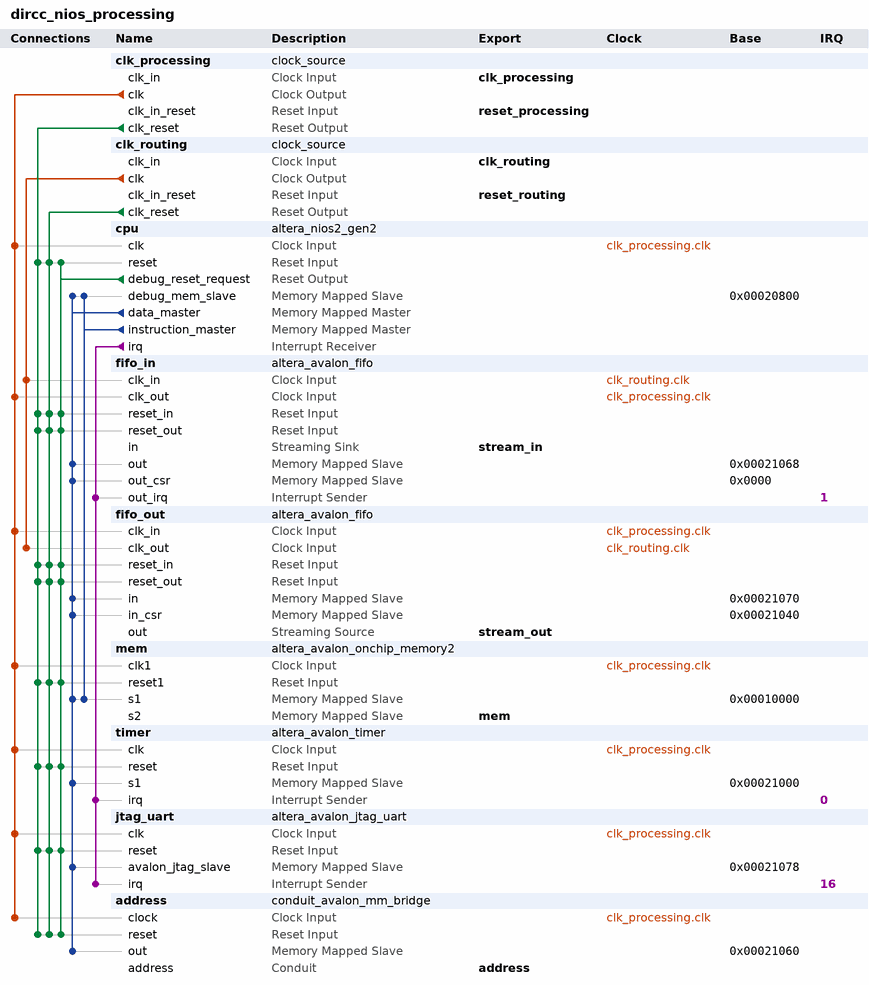
[diagram p0: system contents]
# Platform Designer (Qsys) system dircc_nios_processing, Cyclone V 5CSEMA5F31C6
# Parameters at their usual value, and those the tool derives, are not listed.
package require -exact qsys 16.1
create_system dircc_nios_processing
set_project_property DEVICE_FAMILY {Cyclone V}
set_project_property DEVICE 5CSEMA5F31C6

add_instance clk_processing clock_source 16.1
set_instance_parameter_value clk_processing clockFrequency 50000000
set_instance_parameter_value clk_processing clockFrequencyKnown false
set_instance_parameter_value clk_processing resetSynchronousEdges DEASSERT

add_instance clk_routing clock_source 16.1
set_instance_parameter_value clk_routing clockFrequency 200000000
set_instance_parameter_value clk_routing resetSynchronousEdges DEASSERT

add_instance cpu altera_nios2_gen2 16.1
set_instance_parameter_value cpu dcache_size 1024
set_instance_parameter_value cpu exceptionOffset 3104
set_instance_parameter_value cpu exceptionSlave mem.s1
set_instance_parameter_value cpu icache_size 4096
set_instance_parameter_value cpu impl Tiny
set_instance_parameter_value cpu resetOffset 3072
set_instance_parameter_value cpu resetSlave mem.s1

add_instance fifo_in altera_avalon_fifo 16.1
set_instance_parameter_value fifo_in bitsPerSymbol 8
set_instance_parameter_value fifo_in channelWidth 0
set_instance_parameter_value fifo_in errorWidth 0
set_instance_parameter_value fifo_in fifoDepth 16
set_instance_parameter_value fifo_in fifoInputInterfaceOptions AVALONST_SINK
set_instance_parameter_value fifo_in fifoOutputInterfaceOptions AVALONMM_READ
set_instance_parameter_value fifo_in singleClockMode false
set_instance_parameter_value fifo_in symbolsPerBeat 4
set_instance_parameter_value fifo_in useIRQ true
set_instance_parameter_value fifo_in usePacket true
set_instance_parameter_value fifo_in useReadControl true
set_instance_parameter_value fifo_in useRegister true
set_instance_parameter_value fifo_in useWriteControl false

add_instance fifo_out altera_avalon_fifo 16.1
set_instance_parameter_value fifo_out bitsPerSymbol 8
set_instance_parameter_value fifo_out channelWidth 0
set_instance_parameter_value fifo_out errorWidth 0
set_instance_parameter_value fifo_out fifoDepth 16
set_instance_parameter_value fifo_out fifoInputInterfaceOptions AVALONMM_WRITE
set_instance_parameter_value fifo_out fifoOutputInterfaceOptions AVALONST_SOURCE
set_instance_parameter_value fifo_out singleClockMode false
set_instance_parameter_value fifo_out symbolsPerBeat 4
set_instance_parameter_value fifo_out useIRQ false
set_instance_parameter_value fifo_out usePacket true
set_instance_parameter_value fifo_out useReadControl false
set_instance_parameter_value fifo_out useRegister true

add_instance mem altera_avalon_onchip_memory2 16.1
set_instance_parameter_value mem dataWidth 32
set_instance_parameter_value mem dualPort true
set_instance_parameter_value mem enableDiffWidth true
set_instance_parameter_value mem initMemContent true
set_instance_parameter_value mem initializationFileName /home/patrick/Documents/Coursework/DiRCC/software/dircc_application_gals_27/mem_init/dircc_system_node_dual_node_0_processing_mem.hex
set_instance_parameter_value mem memorySize 30000
set_instance_parameter_value mem readDuringWriteMode OLD_DATA
set_instance_parameter_value mem resetrequest_enabled false
set_instance_parameter_value mem singleClockOperation true
set_instance_parameter_value mem useNonDefaultInitFile true

add_instance timer altera_avalon_timer 16.1
set_instance_parameter_value timer period 1
set_instance_parameter_value timer periodUnits MSEC

add_instance jtag_uart altera_avalon_jtag_uart 16.1
set_instance_parameter_value jtag_uart readBufferDepth 8
set_instance_parameter_value jtag_uart readIRQThreshold 4
set_instance_parameter_value jtag_uart simInteractiveOptions NO_INTERACTIVE_WINDOWS
set_instance_parameter_value jtag_uart writeBufferDepth 8
set_instance_parameter_value jtag_uart writeIRQThreshold 4

add_instance address conduit_avalon_mm_bridge 1.0

# connections
add_connection clk_processing.clk address.clock clock
add_connection clk_processing.clk cpu.clk clock
add_connection clk_processing.clk fifo_in.clk_out clock
add_connection clk_processing.clk fifo_out.clk_in clock
add_connection clk_processing.clk jtag_uart.clk clock
add_connection clk_processing.clk mem.clk1 clock
add_connection clk_processing.clk timer.clk clock
add_connection clk_routing.clk fifo_in.clk_in clock
add_connection clk_routing.clk fifo_out.clk_out clock
add_connection clk_processing.clk_reset address.reset reset
add_connection clk_processing.clk_reset cpu.reset reset
add_connection clk_processing.clk_reset fifo_in.reset_in reset
add_connection clk_processing.clk_reset fifo_in.reset_out reset
add_connection clk_processing.clk_reset fifo_out.reset_in reset
add_connection clk_processing.clk_reset fifo_out.reset_out reset
add_connection clk_processing.clk_reset jtag_uart.reset reset
add_connection clk_processing.clk_reset mem.reset1 reset
add_connection clk_processing.clk_reset timer.reset reset
add_connection clk_routing.clk_reset address.reset reset
add_connection clk_routing.clk_reset cpu.reset reset
add_connection clk_routing.clk_reset fifo_in.reset_in reset
add_connection clk_routing.clk_reset fifo_in.reset_out reset
add_connection clk_routing.clk_reset fifo_out.reset_in reset
add_connection clk_routing.clk_reset fifo_out.reset_out reset
add_connection clk_routing.clk_reset jtag_uart.reset reset
add_connection clk_routing.clk_reset mem.reset1 reset
add_connection clk_routing.clk_reset timer.reset reset
add_connection cpu.debug_reset_request address.reset reset
add_connection cpu.debug_reset_request cpu.reset reset
add_connection cpu.debug_reset_request fifo_in.reset_in reset
add_connection cpu.debug_reset_request fifo_in.reset_out reset
add_connection cpu.debug_reset_request fifo_out.reset_in reset
add_connection cpu.debug_reset_request fifo_out.reset_out reset
add_connection cpu.debug_reset_request jtag_uart.reset reset
add_connection cpu.debug_reset_request mem.reset1 reset
add_connection cpu.debug_reset_request timer.reset reset
add_connection cpu.data_master address.out avalon
set_connection_parameter_value cpu.data_master/address.out baseAddress 0x00021060
add_connection cpu.data_master cpu.debug_mem_slave avalon
set_connection_parameter_value cpu.data_master/cpu.debug_mem_slave baseAddress 0x00020800
add_connection cpu.data_master fifo_in.out avalon
set_connection_parameter_value cpu.data_master/fifo_in.out baseAddress 0x00021068
add_connection cpu.data_master fifo_in.out_csr avalon
set_connection_parameter_value cpu.data_master/fifo_in.out_csr baseAddress 0x0000
add_connection cpu.data_master fifo_out.in avalon
set_connection_parameter_value cpu.data_master/fifo_out.in baseAddress 0x00021070
add_connection cpu.data_master fifo_out.in_csr avalon
set_connection_parameter_value cpu.data_master/fifo_out.in_csr baseAddress 0x00021040
add_connection cpu.data_master jtag_uart.avalon_jtag_slave avalon
set_connection_parameter_value cpu.data_master/jtag_uart.avalon_jtag_slave baseAddress 0x00021078
add_connection cpu.data_master mem.s1 avalon
set_connection_parameter_value cpu.data_master/mem.s1 baseAddress 0x00010000
add_connection cpu.data_master timer.s1 avalon
set_connection_parameter_value cpu.data_master/timer.s1 baseAddress 0x00021000
add_connection cpu.instruction_master cpu.debug_mem_slave avalon
set_connection_parameter_value cpu.instruction_master/cpu.debug_mem_slave baseAddress 0x00020800
add_connection cpu.instruction_master mem.s1 avalon
set_connection_parameter_value cpu.instruction_master/mem.s1 baseAddress 0x00010000
add_connection cpu.irq fifo_in.out_irq interrupt
set_connection_parameter_value cpu.irq/fifo_in.out_irq irqNumber 1
add_connection cpu.irq jtag_uart.irq interrupt
set_connection_parameter_value cpu.irq/jtag_uart.irq irqNumber 16
add_connection cpu.irq timer.irq interrupt
set_connection_parameter_value cpu.irq/timer.irq irqNumber 0

# exported interfaces
add_interface address conduit end
set_interface_property address EXPORT_OF address.address
add_interface clk_processing clock sink
set_interface_property clk_processing EXPORT_OF clk_processing.clk_in
add_interface clk_routing clock sink
set_interface_property clk_routing EXPORT_OF clk_routing.clk_in
add_interface mem avalon slave
set_interface_property mem EXPORT_OF mem.s2
add_interface reset_processing reset sink
set_interface_property reset_processing EXPORT_OF clk_processing.clk_in_reset
add_interface reset_routing reset sink
set_interface_property reset_routing EXPORT_OF clk_routing.clk_in_reset
add_interface stream_in avalon_streaming sink
set_interface_property stream_in EXPORT_OF fifo_in.in
add_interface stream_out avalon_streaming source
set_interface_property stream_out EXPORT_OF fifo_out.out

set_interconnect_requirement {$system} qsys_mm.clockCrossingAdapter HANDSHAKE
set_interconnect_requirement {$system} qsys_mm.enableEccProtection FALSE
set_interconnect_requirement {$system} qsys_mm.insertDefaultSlave FALSE
set_interconnect_requirement {$system} qsys_mm.maxAdditionalLatency 1

save_system dircc_nios_processing.qsys
